# EAGLE design FB-UPLpc936geroutet (EAGLE 5.03)
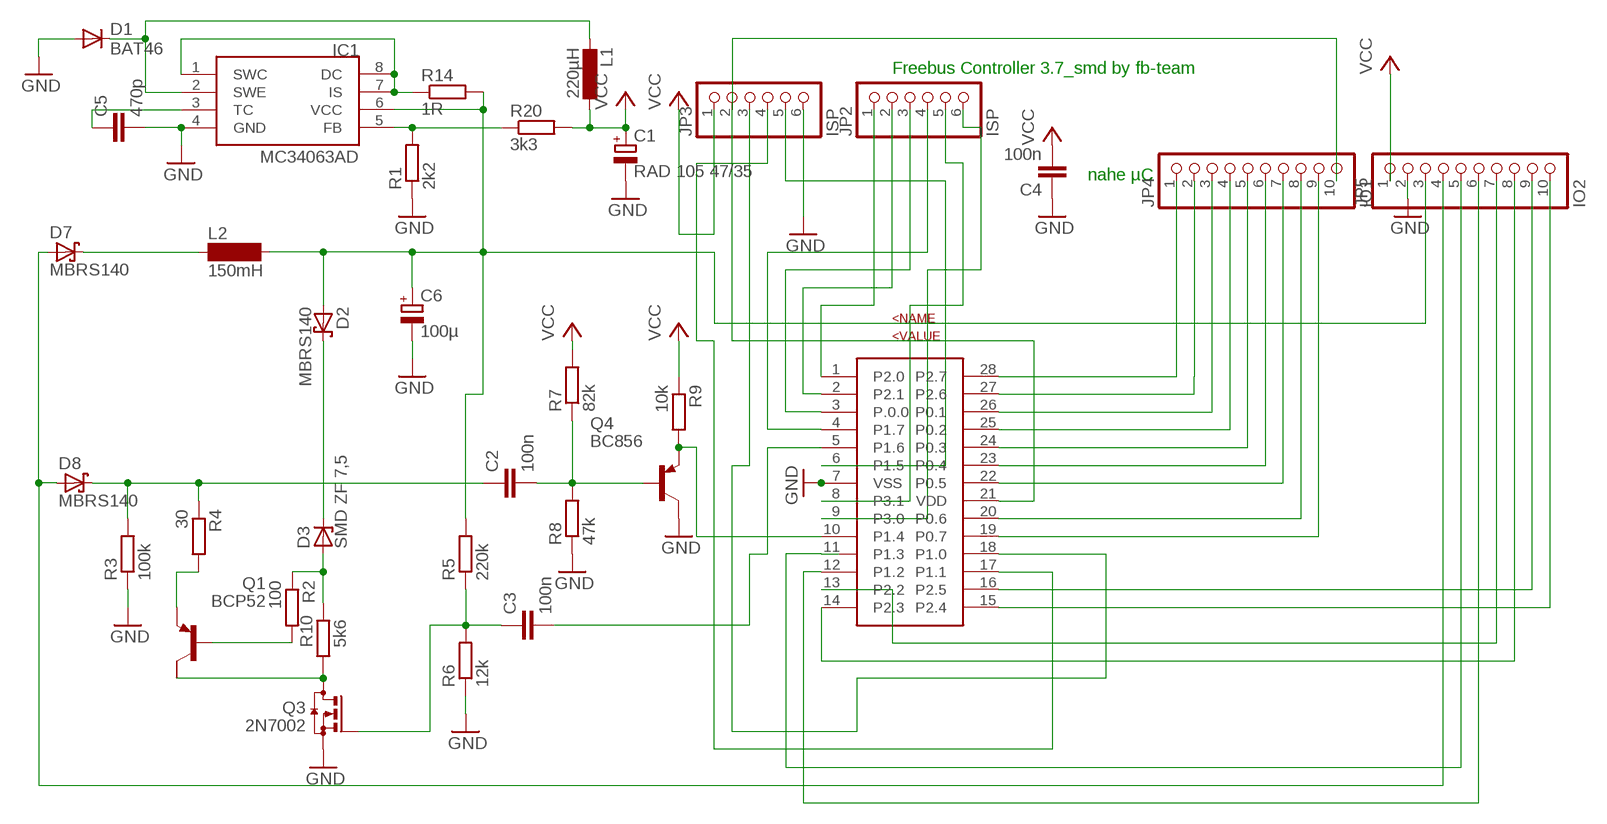
[diagram p0: schematic, sheet 1]

## Parts
C1  RAD 105 47/35  CPOL-EUE2-5  [E2-5]
C2  100n  C-EUC1206  [C1206]
C3  100n  C-EUC1206  [C1206]
C4  100n  C-EUC1206  [C1206]
C5  470p  C-EUC1206  [C1206]
C6  100µ  CPOL-EUE2.5-7  [E2,5-7]
D1  BAT46  DIODE-MINIMELF  [MINIMELF]
D2  MBRS140  MBRS130LT3  [SMB]
D3  SMD ZF 7,5  ZPD  [MINIMELF]
D7  MBRS140  MBRS130LT3  [SMB]
D8  MBRS140  MBRS130LT3  [SMB]
IC1  MC34063AD  [SOIC8]
JP2  ISP  PINHD-1X6  [1X06]
JP3  ISP  PINHD-1X6  [1X06]
JP4  IO1  PINHD-1X10  [1X10]
JP5  IO2  PINHD-1X10  [1X10]
L1  220µH  L-EU2200-11.43  [2200-11.43]
L2  150mH  SD12-1000  [SD12_1000]
Q1  BCP52  FZT753SMD  [SOT223]
Q3  2N7002  BSS123  [SOT23]
Q4  BC856  BC856ALT1SMD  [SOT23-BEC]
R1  2k2  R-EU_R1206  [R1206]
R2  100  R-EU_M1206  [M1206]
R3  100k  R-EU_M1206  [M1206]
R4  30  R-EU_R1206  [R1206]
R5  220k  R-EU_R1206  [R1206]
R6  12k  R-EU_M1206  [M1206]
R7  82k  R-EU_R1206  [R1206]
R8  47k  R-EU_M1206  [M1206]
R9  10k  R-EU_R1206  [R1206]
R10  5k6  R-EU_M1206  [M1206]
R14  1R  R-EU_M1206  [M1206]
R20  3k3  R-EU_M1206  [M1206]
U$1  LPC936TSSOP28  [TSSOP28]

## Nets
GND: C1.- C4.1 C5.2 C6.- D1.A IC1.4(GND) JP3.6 JP5.2 Q3.2(S) Q4.C R1.1 R3.1 R6.1 R8.1 U$1.7(VSS)
N$1: Q4.E R9.2 U$1.10(P1.4)
N$2: C2.2 Q4.B R7.1 R8.2
N$3: IC1.5(FB) R1.2 R20.1
N$4: IC1.1(SWC) IC1.7(IS) IC1.8(DC) R14.1
N$5: C3.2 U$1.5(P1.6)
N$6: Q1.2(C) Q3.3(D) R10.1
N$7: C6.+ D2.A IC1.6(VCC) JP5.3 L2.2 R5.2 R14.2
N$8: D7.C L2.1
N$9: C2.1 D8.C R3.2 R4.1
N$10: D1.C IC1.2(SWE) L1.2
N$11: D3.A R2.1 R10.2
N$12: Q1.3(E) R4.2
N$13: C5.1 IC1.3(TC)
N$14: Q1.1(B) R2.2
N$15: JP4.1 U$1.28(P2.7)
N$16: D7.A D8.A JP5.4
N$17: JP4.2 U$1.27(P2.6)
N$18: JP4.3 U$1.26(P0.1)
N$19: JP4.4 U$1.25(P0.2)
N$20: JP4.5 U$1.24(P0.3)
N$21: JP4.6 U$1.23(P0.4)
N$22: JP4.7 U$1.22(P0.5)
N$23: JP4.8 U$1.20(P0.6)
N$24: JP4.9 U$1.19(P0.7)
N$25: JP3.3 U$1.18(P1.0)
N$27: JP2.1 U$1.1(P2.0)
N$28: JP2.2 U$1.2(P2.1)
N$29: JP2.3 U$1.3(P.0.0)
N$30: JP2.4 U$1.4(P1.7)
N$31: JP3.2 JP4.10 U$1.21(VDD)
N$32: JP5.6 U$1.12(P1.2)
N$33: JP3.4 U$1.17(P1.1)
N$34: C3.1 Q3.1(G) R5.1 R6.2
N$35: JP3.5 U$1.6(P1.5)
N$36: JP5.5 U$1.11(P1.3)
N$37: JP2.5 U$1.8(P3.1)
N$38: JP2.6 U$1.9(P3.0)
N$39: JP5.7 U$1.13(P2.2)
N$40: D2.C D3.C
N$41: JP5.8 U$1.14(P2.3)
N$42: JP5.9 U$1.16(P2.5)
N$43: JP5.10 U$1.15(P2.4)
VCC: C1.+ C4.2 JP3.1 JP5.1 L1.1 R7.2 R9.1 R20.2
Unconnected: Q1.4(C/)

## Notes on the sheet
- Freebus Controller 3.7_smd by fb-team
- nahe µC

## Library data of the parts
C1 C6 = rcl:CPOL-EU: POLARIZED CAPACITOR, European symbol
C2-C5 = rcl:C-EU: CAPACITOR, European symbol
D1 = diode:DIODE-: DIODE
D2 D7 D8 = diode:MBRS130LT3: Schottky Power Rectifier Source: http://www.onsemi.com/pub/Collateral/MBRS130LT3-D.PDF
D3 = diode:ZPD: Z DIODE 500 mW
IC1 = mc34063:MC34063
JP2 JP3 = pinhead:PINHD-1X6: PIN HEADER
JP4 JP5 = pinhead:PINHD-1X10: PIN HEADER
L1 = rcl:L-EU: INDUCTOR, European symbol
L2 = inductor-neosid:SD12: INDUCTOR nominal inductance
Q1 = transistor-pnp:FZT753SMD: PNP Transistor
Q3 = transistor-small-signal:BSS123: N-CHANNEL MOS FET
Q4 = transistor-pnp:BC856*: PNP Transistror
R1-R10 R14 R20 = rcl:R-EU_: RESISTOR, European symbol
U$1 = freebuslpc:LPC936: C51 Based Microcontroller LPC936 ADC and 16kbyte Flash

## Board
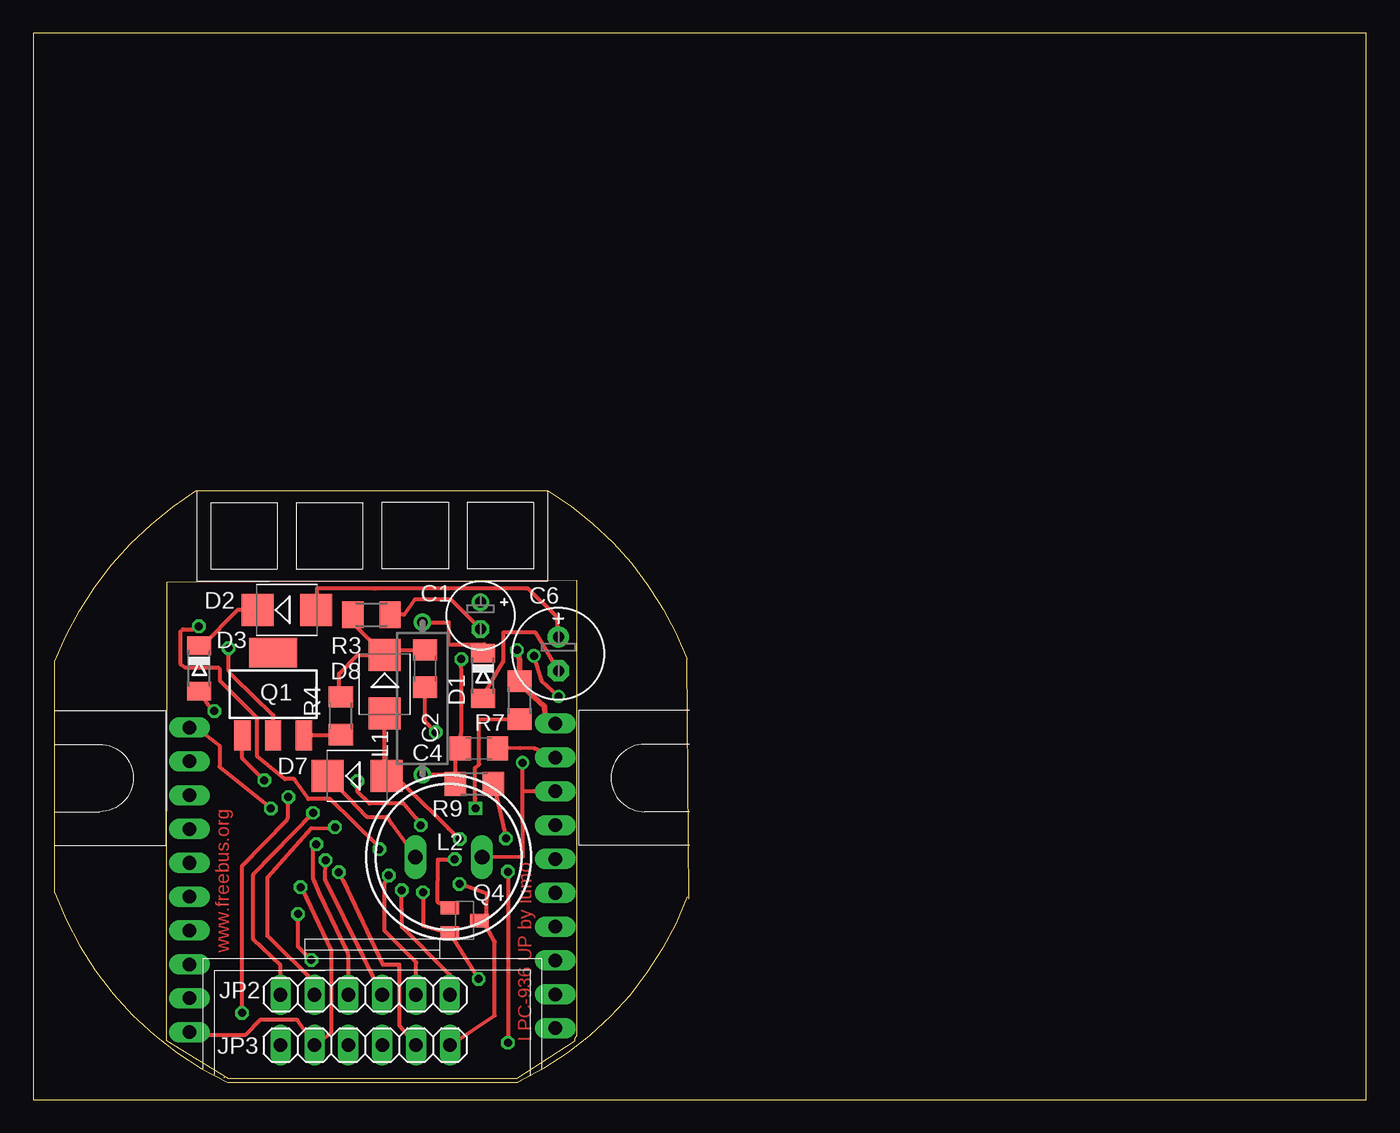
[diagram p1: board, top side]
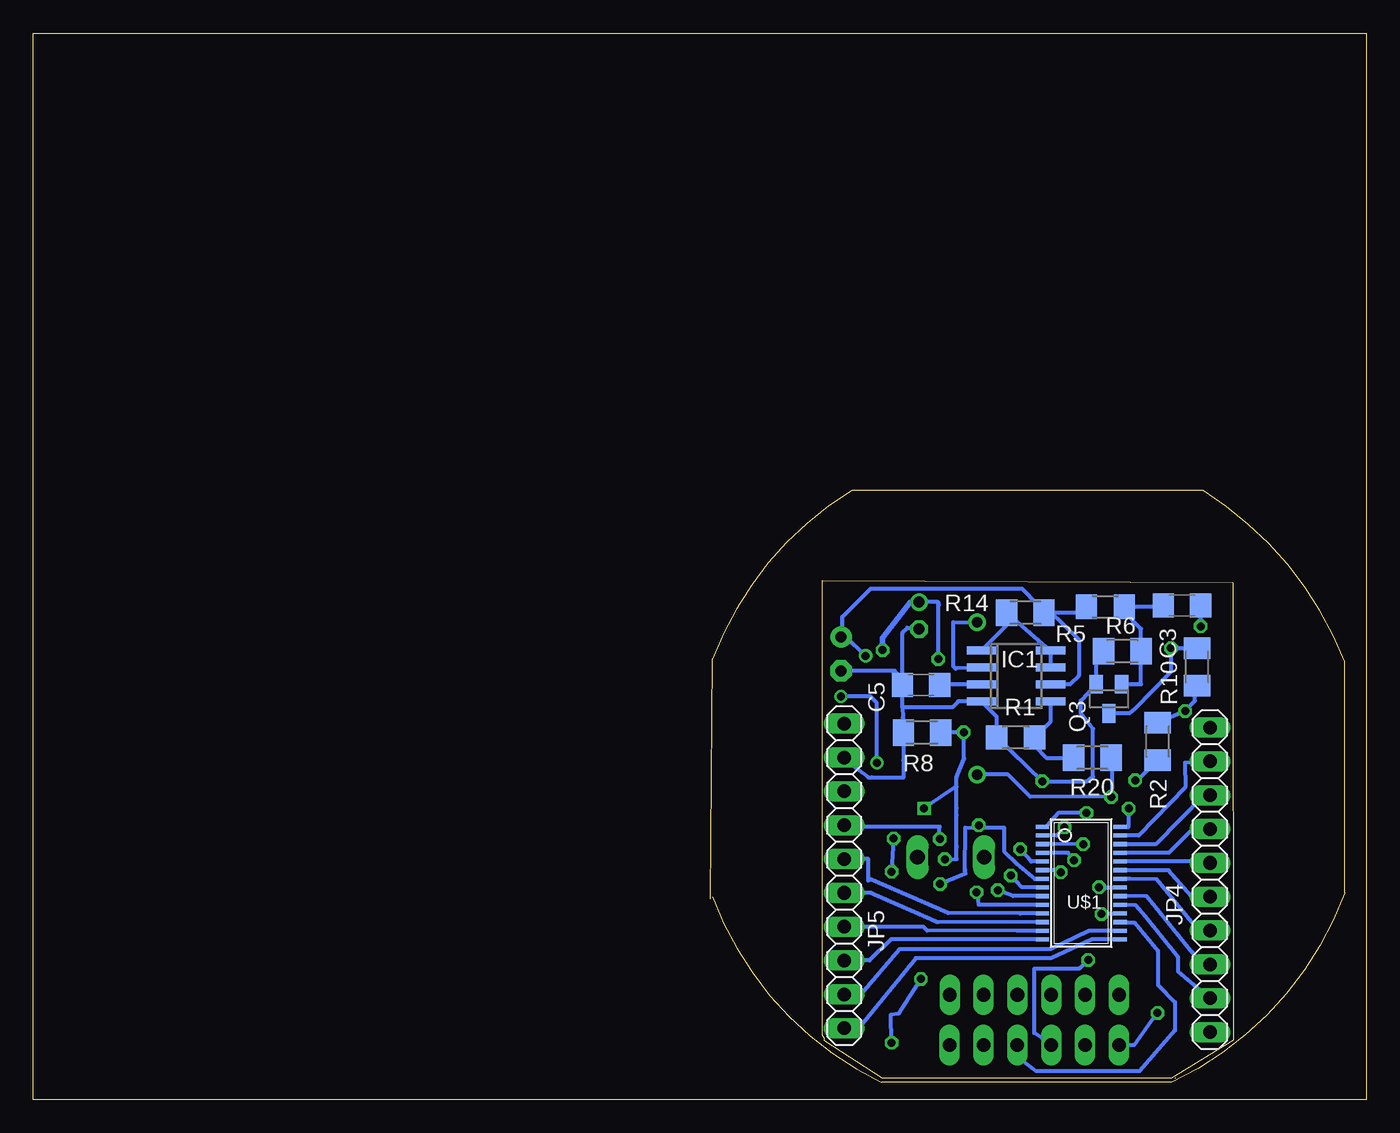
[diagram p2: board, bottom side, seen from below]

Size 100 x 80 mm. Coordinates in mm from the lower left corner, seen from the top.
Outline: 12.23,45.68 38.59,45.68
Outline: 49.18,15.06 49.05,33.05
Outline: 14.57,1.3 36.37,1.3
Outline: 14.56,1.3 arc-44 1.62,15.49 1.62,32.88 arc-36 12.23,45.68
Outline: 38.59,45.68 arc-38 49.05,33.05
Outline: 49.04,15.21 arc-44 36.37,1.3
Outline: 14.36,1.64 14.29,1.64
Outline: 0,0 100,0 100,80 0,80 0,0
Copper layers (1*16): Top 0.035mm / dielectric 1.5mm / Bottom 0.035mm
Design rules "default": minimum track width 10mil, minimum drill 24mil, track to track 8mil, track to pad 8mil, pad to pad 8mil, via to via 8mil, smd to smd 8mil, copper to edge 40mil, drill to drill 8mil, minimum pad ring 10mil, minimum via ring 8mil, stop-mask expansion 4mil, vias tented up to drill 0mil, thermal gap 10mil
Milling: area 10,1.6 to 40.8,38.9

### Footprints (pad centres in the part's own frame; a part is rotated, then mirrored left to right if it is on the bottom)
E2-5 = drill 0.813 pad 1.27 round: + -1.016,0 | drill 0.813 pad 1.27 octagon: - 1.016,0
C1206 = smd 1.6 x 1.8: 1 -1.4,0; 2 1.4,0
E2,5-7 = drill 0.813 pad 1.6 round: + -1.27,0 | drill 0.813 pad 1.6 octagon: - 1.27,0
MINIMELF = smd 1.4 x 1.8: A 1.7,0; C -1.7,0
SMB = smd 2.4 x 2.4: A 2.2,0; C -2.2,0
SOIC8 = smd 0.6 x 2.2: 1 -1.905,-2.6; 2 -0.635,-2.6; 3 0.635,-2.6; 4 1.905,-2.6; 5 1.905,2.6; 6 0.635,2.6; 7 -0.635,2.6; 8 -1.905,2.6
1X06 = drill 1.016 long: 1 -6.35,0; 2 -3.81,0; 3 -1.27,0; 4 1.27,0; 5 3.81,0; 6 6.35,0
1X10 = drill 1.016 long: 1 -11.43,0; 2 -8.89,0; 3 -6.35,0; 4 -3.81,0; 5 -1.27,0; 6 1.27,0; 7 3.81,0; 8 6.35,0; 9 8.89,0; 10 11.43,0
2200-11.43 = drill 0.8 pad 1.27 round: 1 -5.715,0; 2 5.715,0
SD12_1000 = drill 1.1 long: 1 -2.5,0; 2 2.5,0
SOT223 = smd 1.219 x 2.235: 1 -2.311,-3.099; 2 0,-3.099; 3 2.311,-3.099 | smd 3.6 x 2.2: 4 0,3.099
SOT23 = smd 1 x 1.4: 1 -0.95,-1.1; 2 0.95,-1.1; 3 0,1.1
SOT23-BEC = smd 1 x 1.4: B -0.95,-1.1; C 0,1.1; E 0.95,-1.1
R1206 = smd 1.6 x 1.803: 1 -1.422,0; 2 1.422,0
M1206 = smd 1.6 x 2: 1 -1.4,0; 2 1.4,0
TSSOP28 = smd 0.305 x 0.991: 1 -4.225,-2.918; 2 -3.575,-2.918; 3 -2.925,-2.918; 4 -2.275,-2.918; 5 -1.625,-2.918; 6 -0.975,-2.918; 7 -0.325,-2.918; 8 0.325,-2.918; 9 0.975,-2.918; 10 1.625,-2.918; 11 2.275,-2.918; 12 2.925,-2.918; 13 3.575,-2.918; 14 4.225,-2.918; 15 4.225,2.918; 16 3.575,2.918; 17 2.925,2.918; 18 2.275,2.918; 19 1.625,2.918; 20 0.975,2.918; 21 0.325,2.918; 22 -0.325,2.918; 23 -0.975,2.918; 24 -1.625,2.918; 25 -2.275,2.918; 26 -2.925,2.918; 27 -3.575,2.918; 28 -4.225,2.918

### Placement (x,y rotation side)
C1  33.55,36.31 270 top
C2  29.38,32.33 270 top
C3  13.82,37.05 0 bottom
C4  33.43,26.35 180 top
C5  33.39,31.09 180 bottom
C6  39.4,33.44 270 top
D1  33.76,31.79 270 top
D2  19.02,36.74 0 top
D3  12.46,32.34 270 top
D7  24.29,24.28 0 top
D8  26.36,31.15 270 top
IC1  26.27,31.78 270 bottom
JP2  24.9,7.86 0 top
JP3  24.9,4.08 0 top
JP4  11.72,16.49 270 bottom
JP5  39.16,16.78 270 bottom
L1  29.19,30.09 90 top
L2  31.16,18.2 0 top
Q1  17.99,30.43 0 top
Q3  19.3,30.07 180 bottom
Q4  32.36,13.43 270 top
R1  26.29,27.17 0 bottom
R2  15.64,26.87 270 bottom
R3  25.37,36.38 180 top
R4  23.07,28.79 270 top
R5  19.57,36.98 180 bottom
R6  18.3,33.64 0 bottom
R7  36.47,29.96 90 top
R8  33.32,27.53 0 bottom
R9  33.09,23.67 0 top
R10  12.68,32.46 270 bottom
R14  25.58,36.54 0 bottom
R20  20.54,25.64 0 bottom
U$1  21.39,16.24 270 bottom

### Tracks (layer width: path | path; a pad name or v marks a point on that pad's centre or on a via)
GND  (via drill 0.6)
  Top 0.305: R3.1 27.8,36.38 28.61,37.52 31.36,37.52 C1.- | C4.1 35.29,26.35 36.53,26.36 37.62,26.34 JP5.2 | Q4.C 33.74,13.36 33.98,13 | 33.98,13 34.04,15.42 v31.98,16.17 | D1.A 33.45,29.75 35.25,32.87 35.25,35.04 37.66,35.04 C6.- | 24.32,23.77 24.32,23.09 25.22,22.2 27.77,22.2 28.73,21.1 29.08,20.6 v29.06,20.58 | 33.98,13 34.61,11.85 34.61,6.31 JP3.6
  Top 0.406: 24.32,23.77 v24.31,23.88 | v29.06,20.58 v29.06,20.59 | JP3.6 31.5,3.97
  Bottom 0.305: 34.8,29.43 31.05,29.42 30.6,29.88 IC1.4 27.72,28.72 R1.1 v24.31,23.88 20.96,23.88 20.49,24.24 20.49,27.84 21.43,28.99 21.41,29.92 20.18,31.23 Q3.2 20.25,33.08 R6.1 | 34.8,29.43 C5.2 34.79,31.58 | 34.79,31.58 34.79,35.04 34.43,35.39 33.56,35.39 33.42,35.25 33.5,35.25 C1.- | C6.- 35.38,32.17 34.79,31.58 | v31.98,16.17 30.06,16.95 30.09,17.25 30.09,17.09 30.06,20.36 30.08,20.39 29.13,20.41 | v29.06,20.58 28.95,20.4 27.78,20.4 27.18,20.4 27.18,18.62 26.25,17.74 24.86,16.56 U$1.7 | 34.8,29.43 34.76,28.66 R8.1 34.72,25.46 34.73,24.15 34.72,24.19 34.72,24.22 34.8,24.15 35.97,24.15 | 35.97,24.15 36.04,24.15 | 35.97,24.15 37.3,24.14 37.35,24.19 37.33,24.17 | 37.33,24.17 38.21,24.82 39.16,25.51 JP5.2 | 37.33,24.17 37.1,24.17
  Bottom 0.406: 29.13,20.41 v29.06,20.58
N$1  (via drill 0.6)
  Top 0.305: v29.24,15.55 29.24,13.06 Q4.E v33.41,9.04 | R9.2 v35.46,19.58 | v35.6,17.09 v35.6,4.26
  Bottom 0.305: U$1.10 29.06,14.62 29.13,15.26 v29.24,15.55 | v35.46,19.58 v35.6,17.09 | v35.6,4.26 35.64,6.38 35.07,6.46 v33.41,9.04
N$2  (via drill 0.6)
  Top 0.305: C2.2 29.38,28.37 v30.19,27.55 | v31.62,18.02 30.34,18.02 30.3,14.84 Q4.B | R7.1 33.44,28.55 33.44,25.14 33.16,24.91 33.16,22.57 v33.17,21.85
  Bottom 0.305: R8.2 31.9,27.55 v30.19,27.55 30.17,27.53 30.17,25.56 30.74,24.18 30.74,23.49 | v31.62,18.02 30.74,18.05 30.73,19.05 | 30.73,19.05 30.74,18.95 | 30.73,19.05 30.74,21.33 30.74,21.87 30.74,23.49 | 30.74,23.49 v33.17,21.85
N$3
  Bottom 0.305: IC1.5 23.67,28.38 R1.2 24.87,26.54 23.94,25.61 21.97,25.61 R20.1
N$4
  Bottom 0.305: IC1.7 IC1.8 23.7,33.65 R14.1 27.05,35.5 IC1.1
N$5  (via drill 0.6)
  Top 0.305: v25.95,18.79 25.92,18.83 25.91,18.69 25.96,18.94 22.27,22.55 20.64,22.55 19.58,24.05 18.87,24.05 16.81,25.75 16.81,28.62 14.01,31.42 14.01,32.28 13.9,32.38 11.4,32.38 11.06,32.63 11.06,35.15 11.21,35.29 11.92,35.29 v12.41,35.5
  Bottom 0.305: U$1.5 25.12,17.86 v25.95,18.79 | v12.41,35.5 C3.2
N$6  (via drill 0.6)
  Top 0.305: Q1.2 17.99,28.82 15.03,31.7 14.91,31.83 14.66,32.16 14.66,33.74 v14.64,33.87
  Bottom 0.305: Q3.3 18.06,28.97 17.76,28.97 17.37,29.3 14.67,32.07 14.66,33.74 v14.64,33.87 | v14.64,33.87 14.6,33.87 12.93,33.87 R10.1 12.76,33.87 v14.64,33.87
N$7  (via drill 0.6)
  Top 0.305: D2.A 21.26,38.33 25.66,38.34 37.12,38.34 39.31,36.19 39.34,35.47 39.32,35.25 39.32,34.78 C6.+ | L2.2 33.98,18.22 36.74,18.23 36.72,23.16 | JP5.3 39.15,23.14 38.25,23.18 38.01,23.16 36.72,23.16 | v37.56,33.29 38.16,31.38 v39.41,30.24 | 36.72,23.16 v36.71,25.27
  Bottom 0.305: R5.2 20.99,36.53 R14.2 24.01,36.63 24.44,36.69 | 24.44,36.69 23.8,36.69 21.57,34.53 21.57,31.8 22.21,31.15 IC1.6 | 24.44,36.69 24.59,36.69 24.66,36.76 24.69,37.19 25.84,38.34 37.16,38.34 39.3,36.21 39.32,34.78 C6.+ 39.04,34.71 v37.56,33.29 | v39.41,30.24 37.21,30.24 36.71,29.75 36.71,25.77 v36.71,25.27
N$8
  Top 0.305: L2.1 26.89,20.7 26.57,21.22 25.01,21.22 D7.C
N$9
  Top 0.305: R3.2 23.97,35.75 D8.C | D8.C 27.36,33.74 C2.1 | D8.C 24.34,33.35 22.93,31.94 22.93,30.35 R4.1
N$10
  Top 0.305: D1.C 33.82,34.15 31.12,34.16 31.16,35.81 L1.2
  Bottom 0.305: IC1.2 30.81,32.34 30.99,32.52 30.99,35.82 L1.2
N$11  (via drill 0.6)
  Top 0.305: D3.A 13.13,29.6 v13.59,29.14
  Bottom 0.305: R10.2 12.85,31.06 12.84,29.92 v13.59,29.14 R2.1
N$12
  Top 0.305: R4.2 20.34,27.36 Q1.3
N$13
  Bottom 0.305: IC1.3 31.94,31.14 C5.1
N$14  (via drill 0.6)
  Top 0.305: Q1.1 15.68,25.6 v17.32,23.95
  Bottom 0.305: v17.32,23.95 17.15,23.95 R2.2
N$15  (via drill 0.6)
  Top 0.305: JP4.1 12.23,27.92 13.98,26.56 13.98,24.96 13.99,24.95 17.57,22.07 v17.82,21.83
  Bottom 0.305: v17.82,21.83 17.86,21.63 17.86,20.44 18.41,20.44 U$1.28
N$16  (via drill 0.6)
  Top 0.305: D8.A 26.36,24.41 D7.A 27.11,24.28 30.13,21.36 31.16,20.34 v31.99,19.55
  Bottom 0.305: v31.99,19.55 32.02,19.54 32.02,20.47 32.52,20.46 37.92,20.46 38.27,20.46 39.05,20.5 39.19,20.43 39.15,20.54 39.16,20.65 JP5.4
N$17
  Bottom 0.305: U$1.27 17.07,19.81 13.57,23.41 13.6,25.27 12.45,25.28 11.82,25.28 JP4.2
N$18
  Bottom 0.305: JP4.3 12.19,22.84 15.79,19.16 18.11,19.16 U$1.26
N$19
  Bottom 0.305: U$1.25 14.8,18.51 13.02,20.3 JP4.4
N$20
  Bottom 0.305: JP4.5 11.56,17.76 13.1,17.8 12.04,17.87 U$1.24
N$21
  Bottom 0.305: JP4.6 13.07,15.2 14.83,17.21 18.28,17.21 U$1.23
N$22
  Bottom 0.305: JP4.7 12.58,12.69 15.71,16.53 17.77,16.57 U$1.22
N$23
  Bottom 0.305: JP4.8 12.27,10.14 13.42,11.47 13,10.96 16.46,15.26 18.2,15.27 U$1.20
N$24
  Bottom 0.305: JP4.9 14.1,9.58 14.1,10.69 16.56,13.73 17.29,14.58 18.09,14.61 U$1.19
N$25  (via drill 0.6)
  Top 0.305: v19.86,13.92 19.86,11.46 v20.85,10.47
  Bottom 0.305: U$1.18 19.63,13.96 v19.86,13.92 | v20.85,10.47 21.5,9.85 23.55,9.83 24.85,9.83 24.86,9.79 24.89,9.83 24.9,9.64 24.9,5 JP3.3
N$27  (via drill 0.6)
  Top 0.305: JP2.1 18.55,10.05 16.51,12.03 16.51,16.88 v20.99,21.5
  Bottom 0.305: v20.99,21.5 23.11,21.5 23.99,20.48 24.65,20.46 U$1.1
N$28  (via drill 0.6)
  Top 0.305: JP2.2 21.09,8.8 17.57,12.27 17.57,16.67 20.89,20.38 22.27,20.35 v22.62,20.44
  Bottom 0.305: v22.62,20.44 22.57,20.45 22.56,20.43 23.2,19.81 U$1.2
N$29  (via drill 0.6)
  Top 0.305: v21.22,19.15 21.23,19.11 21.23,19.13 20.96,19.12 20.96,16.67 20.98,16.56 21.46,15.46 23.59,10.99 23.62,10.75 23.62,7.58 JP2.3
  Bottom 0.305: U$1.3 23.55,19.16 v21.22,19.15
N$30  (via drill 0.6)
  Top 0.305: JP2.4 21.91,16.51 v21.92,17.95
  Bottom 0.305: v21.92,17.95 22.36,18.52 U$1.4
N$31  (via drill 0.6)
  Top 0.305: v20.04,15.92 20.07,15.98 20.06,15.94 20.07,15.99 20.07,16 20.21,15.78 22.38,11.17 22.38,9.69 22.38,9.54 22.38,5.04 JP3.2 21.04,4.26 19.81,5.96 17.02,5.96 15.89,4.83 11.95,4.83 JP4.10
  Bottom 0.305: U$1.21 20.11,15.91 v20.04,15.92
N$32
  Bottom 0.305: JP5.6 37.18,15.51 32.3,13.39 32.16,13.31 U$1.12
N$33
  Top 0.305: JP3.4 26.18,3.74
  Bottom 0.305: U$1.17 18.84,13.33 18.35,13.29 17.39,13.29 15.62,11.16 15.62,8.59 14.34,7.31 14.34,5.18 17.01,2.13 24.78,2.13 26.2,3.21 26.2,3.98 JP3.4
N$34
  Bottom 0.305: C3.1 15.29,36.98 R5.1 18.15,36.58 16.89,35.32 R6.2 16.9,31.17 Q3.1
N$35  (via drill 0.6)
  Top 0.305: v22.91,17.06 23.23,16.46 26.21,10.14 27.34,10.14 27.41,10 27.44,10.02 27.45,10.11 | 27.45,10 27.45,10.11 | 27.45,10.11 27.45,5.55 JP3.5
  Bottom 0.305: U$1.6 22.99,17.21 v22.91,17.07 22.91,17.18 v22.91,17.06
N$36
  Bottom 0.305: JP5.5 37.34,18.05 37.34,16.42 37.32,16.54 37.09,16.5 31.38,13.99 25.94,13.96 U$1.11
N$37  (via drill 0.6)
  Top 0.305: JP2.5 28.73,7.87 28.73,10.29 26.35,12.66 26.35,16.24 v26.67,16.81
  Bottom 0.305: U$1.8 25.82,15.93 v26.67,16.81
N$38  (via drill 0.6)
  Top 0.305: v27.65,15.71 27.66,12.94 31.25,9.36 JP2.6
  Top 0.406: 31.28,7.6 JP2.6
  Bottom 0.305: U$1.9 26.49,15.26 v27.65,15.71
N$39
  Bottom 0.305: JP5.7 33.23,12.97 32.94,12.68 26.17,12.66 U$1.13
N$40
  Top 0.305: D3.C 12.66,34.04 15.38,36.76 16.8,36.76 D2.C
N$41
  Bottom 0.305: JP5.8 37.25,10.43 35.65,12.03 25.96,12.03 U$1.14
N$42
  Bottom 0.305: U$1.16 20.79,12.66 23.7,11.29 35,11.29 37.92,7.9 39.15,7.9 JP5.9
N$43
  Bottom 0.305: U$1.15 20.59,12.01 23.66,10.61 33.79,10.61 38.14,5.27 39.09,5.27 JP5.10
VCC  (via drill 0.6)
  Top 0.305: L1.1 31.66,24.38 | 31.66,24.38 R9.1 | 31.66,24.38 31.66,26.38 C4.2 32,26.88 32.12,27.61 32.12,31.65 v32.1,33.05 | v15.65,6.49 15.65,17.52 19,20.94 19.11,21.18 v19.13,22.7
  Top 0.406: JP5.1 38.44,28.21 38.37,29.5 36.43,31.21 R7.2 36.48,33.03 v36.28,33.73
  Bottom 0.305: L1.1 26.88,24.38 25.23,22.73 v19.13,22.7 19.05,23.45 19.05,25.55 R20.2 | v32.1,33.05 32.08,37.23 32.07,37.07 32.12,37.33 C1.+ | JP3.1 17.4,4.08 v15.65,6.49
  Bottom 0.406: v36.28,33.73 36.28,34.61 34.22,37.31 33.56,37.31 C1.+

### Text on the board
Top: LPC-936 UP by lumo | www.freebus.org